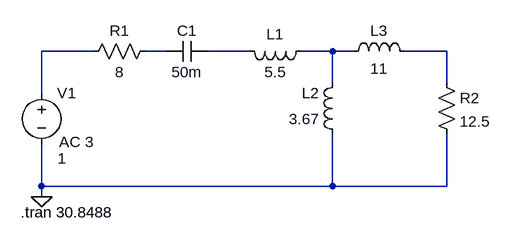
[diagram p0: schematic Task3bb.asc]
Task3bb.asc, the LTspice schematic file:
Version 4
SHEET 1 880 680
WIRE 240 64 160 64
WIRE 352 64 320 64
WIRE 480 64 416 64
WIRE 608 64 560 64
WIRE 640 64 608 64
WIRE 784 64 720 64
WIRE 608 112 608 64
WIRE 784 112 784 64
WIRE 160 128 160 64
WIRE 160 272 160 208
WIRE 608 272 608 192
WIRE 608 272 160 272
WIRE 784 272 784 192
WIRE 784 272 608 272
WIRE 160 288 160 272
FLAG 160 288 0
SYMBOL voltage 160 112 R0
WINDOW 3 25 117 Left 2
WINDOW 123 27 92 Left 2
WINDOW 39 0 0 Left 0
SYMATTR Value 1
SYMATTR Value2 AC 3
SYMATTR InstName V1
SYMBOL res 336 48 R90
WINDOW 0 0 56 VBottom 2
WINDOW 3 32 56 VTop 2
SYMATTR InstName R1
SYMATTR Value 8
SYMBOL cap 416 48 R90
WINDOW 0 0 32 VBottom 2
WINDOW 3 32 32 VTop 2
SYMATTR InstName C1
SYMATTR Value 50m
SYMBOL res 768 96 R0
SYMATTR InstName R2
SYMATTR Value 12.5
SYMBOL ind 576 48 R90
WINDOW 0 5 56 VBottom 2
WINDOW 3 32 56 VTop 2
SYMATTR InstName L1
SYMATTR Value 5.5
SYMBOL ind 624 208 R180
WINDOW 0 36 80 Left 2
WINDOW 3 36 40 Left 2
SYMATTR InstName L2
SYMATTR Value 3.67
SYMBOL ind 624 80 R270
WINDOW 0 32 56 VTop 2
WINDOW 3 5 56 VBottom 2
SYMATTR InstName L3
SYMATTR Value 11
TEXT 128 312 Left 2 !.tran 30.8488

The netlist it stands for:
* Task3bb.asc
V1 N001 0 1 AC 3
R1 N002 N001 8
C1 N003 N002 50m
R2 N005 0 12.5
L1 N004 N003 5.5
L2 0 N004 3.67
L3 N004 N005 11
.tran 30.8488
.backanno
.end